# EAGLE schematic ADP1614_BREAKOUT (EAGLE 7.7.0)
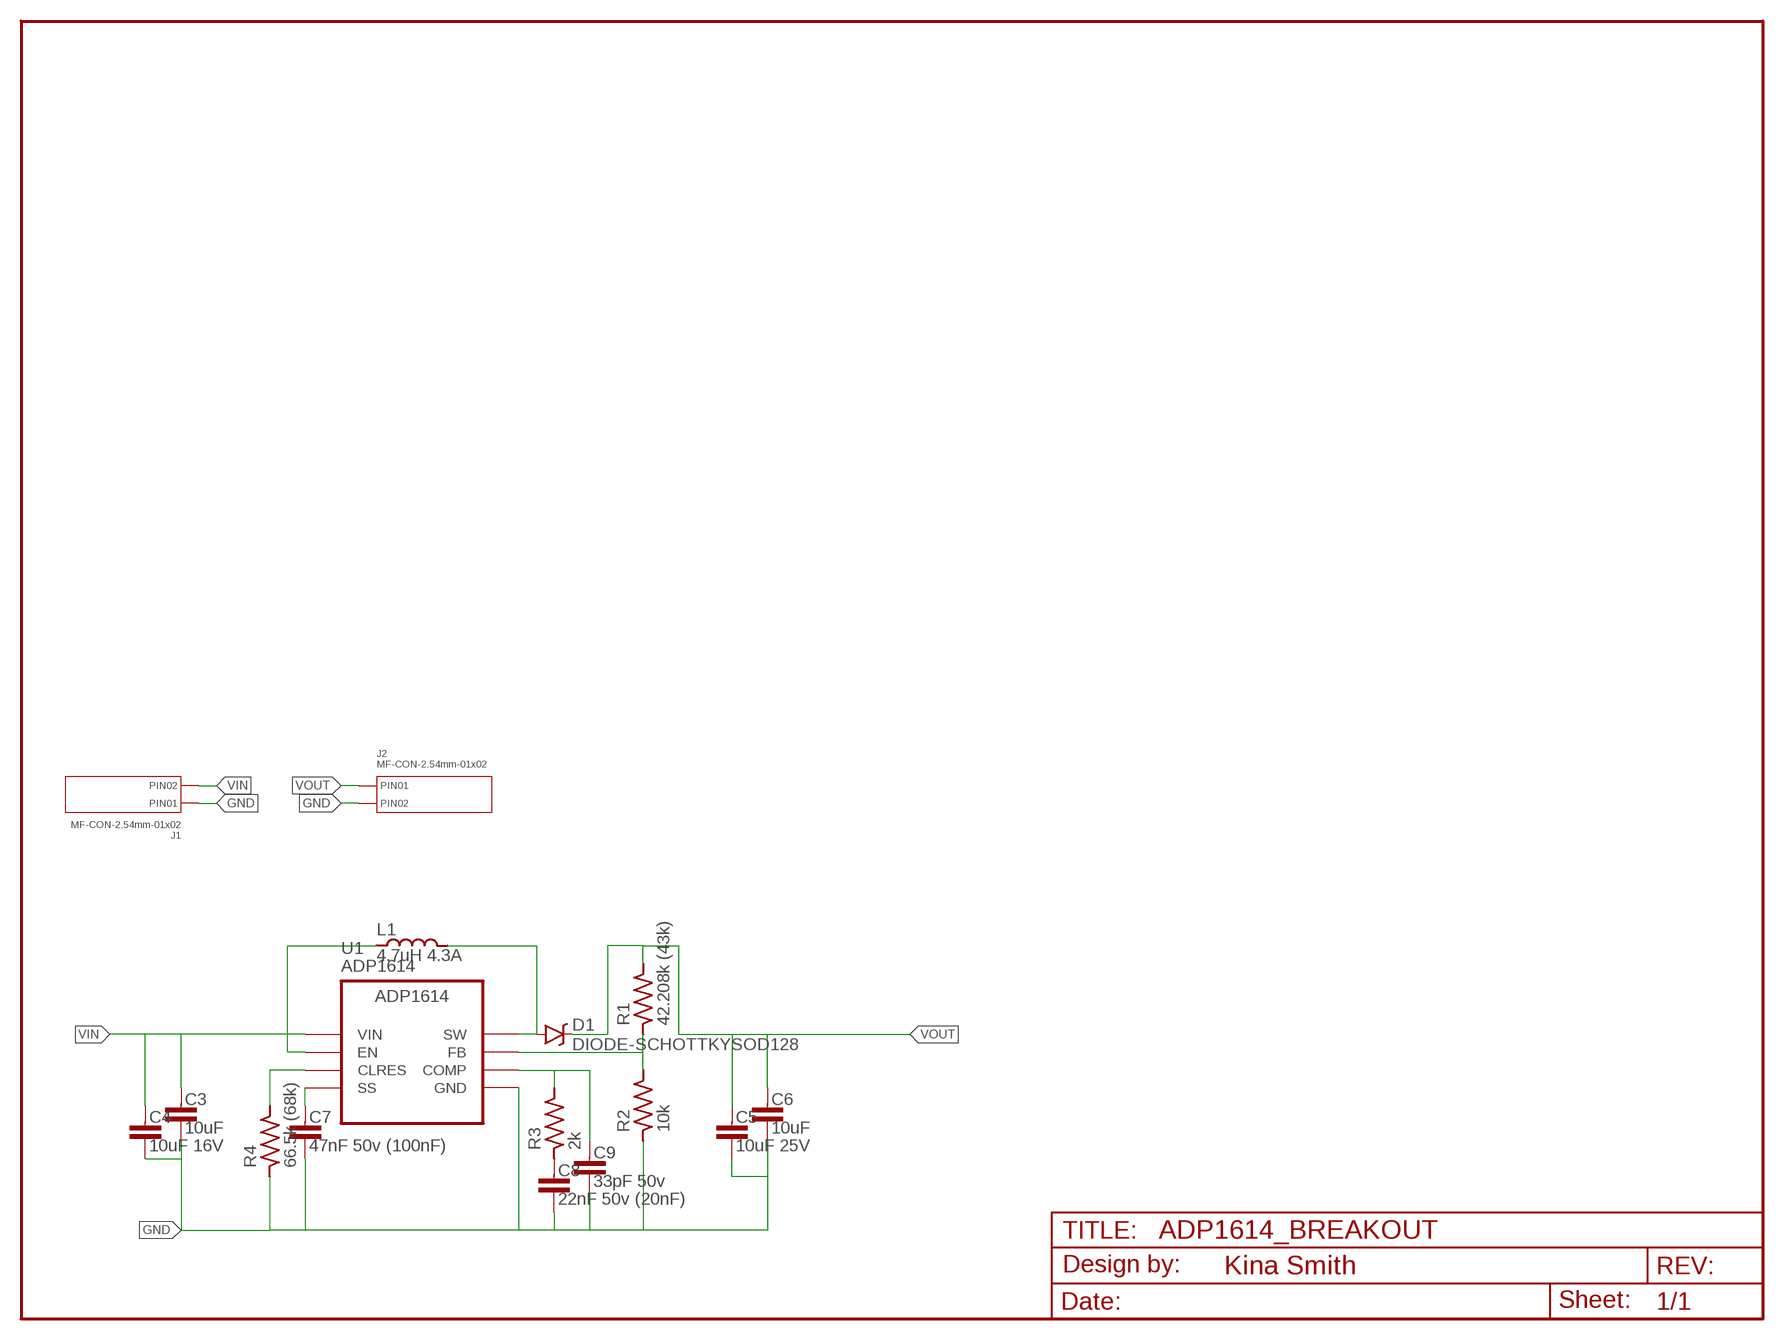
[diagram p0: schematic, sheet 1]

## Parts
C3  10uF  CAPACITOR_NP0805-N  [C0805-N]
C4  10uF 16V  CAPACITOR_NP0805-N  [C0805-N]
C5  10uF 25V  CAPACITOR_NP0805-N  [C0805-N]
C6  10uF  CAPACITOR_NP0805-N  [C0805-N]
C7  47nF 50v (100nF)  CAPACITOR_NP0603-N  [C0603-N]
C8  22nF 50v (20nF)  CAPACITOR_NP0603-N  [C0603-N]
C9  33pF 50v  CAPACITOR_NP0603-N  [C0603-N]
D1  DIODE-SCHOTTKYSOD128  [SOD128]
FRAME1  FRAME-LETTER  [CREATIVE_COMMONS]
J1  MF-CON-2.54mm-01x02  CON_01X02_PTH_2.54MM  [PTH_2.54MM_01X02]
J2  MF-CON-2.54mm-01x02  CON_01X02_PTH_2.54MM  [PTH_2.54MM_01X02]
L1  4.7uH 4.3A  INDUCTOR8080  [L8080]
R1  42.208k (43k)  RESISTOR0603-N  [R0603-N]
R2  10k  RESISTOR0603-N  [R0603-N]
R3  2k  RESISTOR0603-N  [R0603-N]
R4  66.5k (68k)  RESISTOR0603-N  [R0603-N]
U1  ADP1614  [DFN300X300X80-11N]

## Nets
GND: C3.2 C4.2 C5.2 C6.2 C7.2 C8.2 C9.2 J1.P$1(PIN1) J2.P$2(PIN2) R2.1 R4.1 U1.4(GND) U1.5(GND) U1.11(GND)
N$3: R4.2 U1.9(CLRES)
N$4: C7.1 U1.10(SS)
N$6: C8.1 R3.1
N$8: C9.1 R3.2 U1.1(COMP)
N$11: R1.1 R2.2 U1.2(FB)
N$13: D1.A-2(A) L1.2 U1.6(SW) U1.7(SW)
VIN: C3.1 C4.1 J1.P$2(PIN2) L1.1 U1.3(EN) U1.8(VIN)
VOUT: C5.1 C6.1 D1.C-1(C) J2.P$1(PIN1) R1.2

## Library data of the parts
C3-C9 = My_Passives:CAPACITOR_NP
D1 = My_Descrete_Semiconductors:DIODE-SCHOTTKY: Schottky diodes in SFE's production catalog BAT20J 1A 23V 0.62Vf RB751 120mA 40V 0.37Vf PMEG4005EJ 0.5A 40V 0.42Vf MBRA140 1A 40V 0.5Vf B340A 3A 40V SMA
FRAME1 = My_Aesthetics:FRAME-LETTER: Schematic Frame Standard 8.5x11 US Letter frame
J1 J2 = My_Connectors:CON_01X02: Library: MF_Connectors Description: Header Connector with 02 Positions and 01 Rows. Use the LABEL Attribute to label the pin on the schematic and PCB. You can remove the attributes on the PCB by using the SMASH function on the part and then deleting the text.; HOUSEPART: YES; MPN: MF-CON-2.54mm-01x02; POPULATE: 1; URL: https://factory.macrofab.com/part/MF-CON-2.54mm-01x02
L1 = My_Passives:INDUCTOR; PARTNO: NRS8040T100MJGJ
R1-R4 = My_Passives:RESISTOR
U1 = My_IC_Power:ADP1614